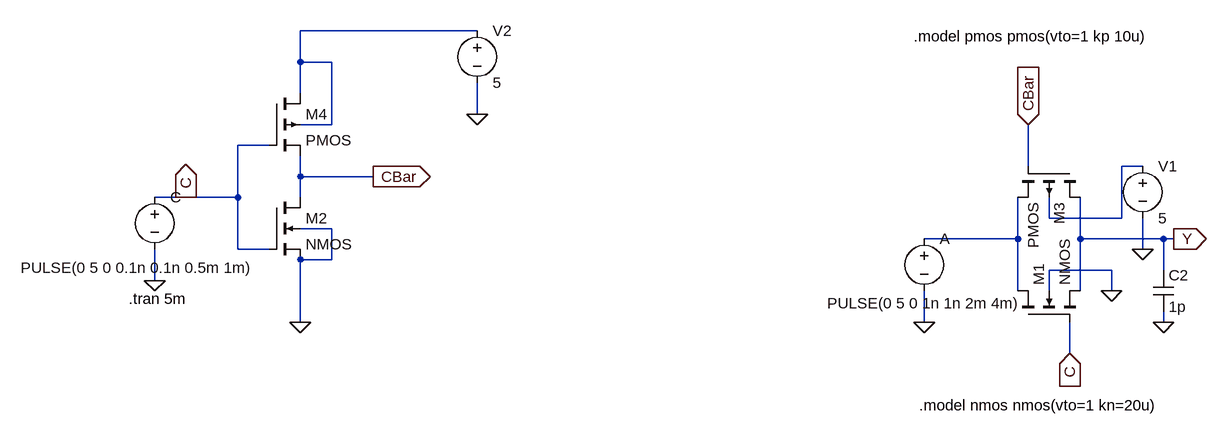
[diagram p0: schematic Exp 4.1 NOR.asc]
Exp 4.1 NOR.asc, the LTspice schematic file:
Version 4
SHEET 1 880 680
WIRE -624 -176 -896 -176
WIRE -896 -128 -896 -176
WIRE -848 -128 -896 -128
WIRE -896 -80 -896 -128
WIRE -624 -48 -624 -96
WIRE -848 -32 -848 -128
WIRE -848 -32 -896 -32
WIRE -944 0 -992 0
WIRE 224 32 224 -32
WIRE 400 32 368 32
WIRE -896 48 -896 16
WIRE -784 48 -896 48
WIRE -1072 80 -1120 80
WIRE -992 80 -992 0
WIRE -992 80 -1072 80
WIRE -896 80 -896 48
WIRE 256 112 256 80
WIRE 368 112 368 32
WIRE 368 112 256 112
WIRE -848 128 -896 128
WIRE 208 144 208 80
WIRE 208 144 64 144
WIRE 304 144 304 80
WIRE 432 144 304 144
WIRE 448 144 432 144
WIRE -992 160 -992 80
WIRE -944 160 -992 160
WIRE 400 160 400 112
WIRE -848 176 -848 128
WIRE -848 176 -896 176
WIRE 352 192 256 192
WIRE 432 192 432 144
WIRE -1120 208 -1120 160
WIRE 208 224 208 144
WIRE 256 224 256 192
WIRE 304 224 304 144
WIRE 352 224 352 192
WIRE -896 272 -896 176
WIRE 64 272 64 224
WIRE 432 272 432 256
WIRE 288 320 288 272
FLAG 448 144 Y
IOPIN 448 144 Out
FLAG 64 272 0
FLAG 224 -32 CBar
IOPIN 224 -32 In
FLAG 288 320 C
IOPIN 288 320 In
FLAG -1120 208 0
FLAG -1072 80 C
IOPIN -1072 80 Out
FLAG -624 -48 0
FLAG -784 48 CBar
IOPIN -784 48 Out
FLAG 352 224 0
FLAG -896 272 0
FLAG 432 272 0
FLAG 400 160 0
SYMBOL nmos4 208 272 R270
SYMATTR InstName M1
SYMATTR Value2 l=5u w=10u
SYMBOL pmos4 304 32 R90
SYMATTR InstName M3
SYMATTR Value2 l=5u w=20u
SYMBOL voltage 64 128 R0
WINDOW 3 -149 115 Left 2
WINDOW 123 0 0 Left 0
WINDOW 39 0 0 Left 0
SYMATTR InstName A
SYMATTR Value PULSE(0 5 0 1n 1n 2m 4m)
SYMBOL voltage -1120 64 R0
WINDOW 3 -206 124 Left 2
WINDOW 123 0 0 Left 0
WINDOW 39 0 0 Left 0
SYMATTR InstName C
SYMATTR Value PULSE(0 5 0 0.1n 0.1n 0.5m 1m)
SYMBOL voltage 400 16 R0
WINDOW 123 0 0 Left 0
WINDOW 39 0 0 Left 0
SYMATTR InstName V1
SYMATTR Value 5
SYMBOL cap 416 192 R0
SYMATTR InstName C2
SYMATTR Value 1p
SYMBOL nmos4 -944 80 R0
SYMATTR InstName M2
SYMBOL pmos4 -944 -80 R0
SYMATTR InstName M4
SYMBOL voltage -624 -192 R0
WINDOW 123 0 0 Left 0
WINDOW 39 0 0 Left 0
SYMATTR InstName V2
SYMATTR Value 5
TEXT 56 400 Left 2 !.model nmos nmos(vto=1 kn=20u)
TEXT 48 -168 Left 2 !.model pmos pmos(vto=1 kp 10u)
TEXT -1160 236 Left 2 !.tran 5m

The netlist it stands for:
* Exp 4.1 NOR.asc
M1 N003 C Y 0 NMOS l=5u w=10u
M3 Y CBar N003 N002 PMOS l=5u w=20u
V§A N003 0 PULSE(0 5 0 1n 1n 2m 4m)
V§C C 0 PULSE(0 5 0 0.1n 0.1n 0.5m 1m)
V1 N002 0 5
C2 Y 0 1p
M2 CBar C 0 0 NMOS
M4 N001 C CBar N001 PMOS
V2 N001 0 5
.model NMOS NMOS
.model PMOS PMOS
.lib standard.mos
.model nmos nmos(vto=1 kn=20u)
.model pmos pmos(vto=1 kp 10u)
.tran 5m
.backanno
.end